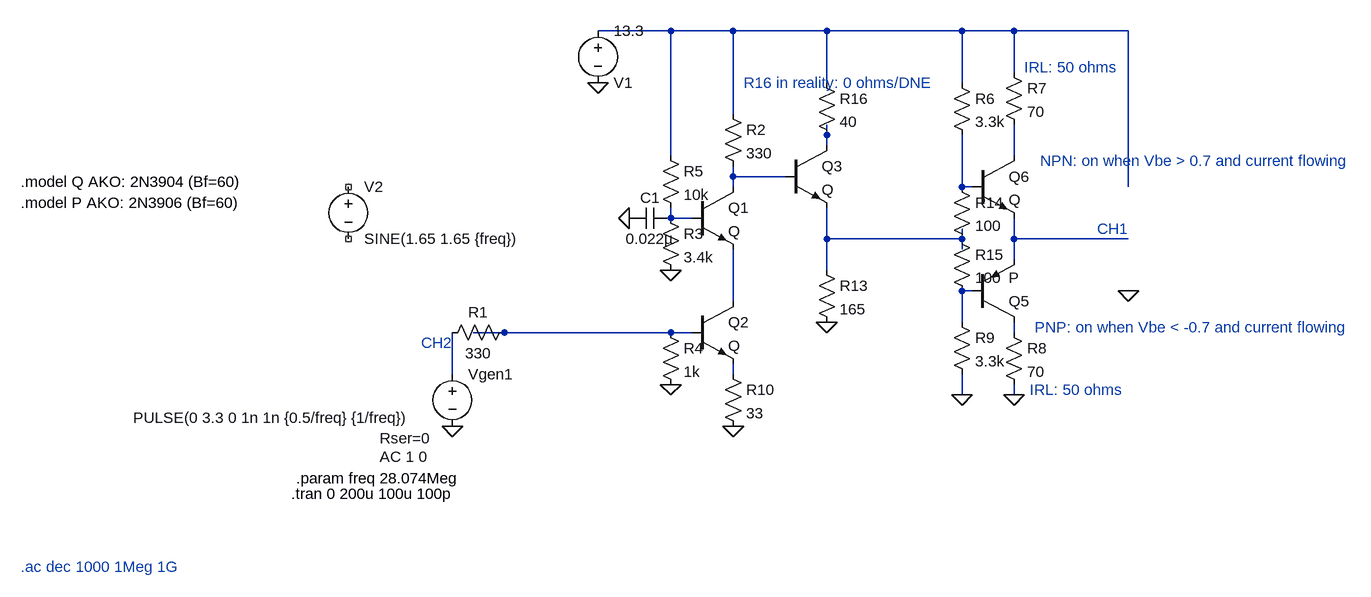
[diagram p0: schematic cascode.asc]
cascode.asc, the LTspice schematic file:
Version 4
SHEET 1 1604 680
WIRE 128 -480 16 -480
WIRE 224 -480 128 -480
WIRE 368 -480 224 -480
WIRE 576 -480 368 -480
WIRE 656 -480 576 -480
WIRE 832 -480 656 -480
WIRE 656 -416 656 -480
WIRE 368 -400 368 -480
WIRE 576 -400 576 -480
WIRE 224 -352 224 -480
WIRE 368 -320 368 -336
WIRE 368 -304 368 -320
WIRE 128 -288 128 -480
WIRE 656 -288 656 -336
WIRE 224 -256 224 -272
WIRE 304 -256 224 -256
WIRE 224 -240 224 -256
WIRE 576 -240 576 -320
WIRE 592 -240 576 -240
WIRE 832 -240 832 -480
WIRE 128 -192 128 -208
WIRE 160 -192 128 -192
WIRE 368 -160 368 -208
WIRE 576 -160 576 -176
WIRE 576 -160 368 -160
WIRE 656 -160 656 -192
WIRE 832 -160 656 -160
WIRE 576 -144 576 -160
WIRE 656 -128 656 -160
WIRE 368 -112 368 -160
WIRE 592 -80 576 -80
WIRE 224 -64 224 -144
WIRE 576 -32 576 -80
WIRE -128 -16 -176 -16
WIRE 128 -16 -128 -16
WIRE 160 -16 128 -16
WIRE 656 -16 656 -32
WIRE -208 48 -208 -16
WIRE 224 48 224 32
WIRE 576 80 576 48
WIRE 656 80 656 64
FLAG -208 128 0
FLAG 16 -400 0
FLAG 128 64 0
FLAG 64 -192 0
FLAG 224 128 0
FLAG 128 -112 0
FLAG 656 80 0
FLAG 576 80 0
FLAG 368 -32 0
FLAG 832 -80 0
SYMBOL voltage -208 32 R0
WINDOW 123 -112 143 Left 2
WINDOW 39 -112 115 Left 2
WINDOW 3 -491 83 Left 2
SYMATTR Value2 AC 1 0
SYMATTR SpiceLine Rser=0
SYMATTR Value PULSE(0 3.3 0 1n 1n {0.5/freq} {1/freq})
SYMATTR InstName Vgen1
SYMBOL res -112 -32 R90
WINDOW 0 0 56 VBottom 2
WINDOW 3 32 56 VTop 2
SYMATTR InstName R1
SYMATTR Value 330
SYMBOL npn 160 -64 R0
SYMATTR InstName Q2
SYMATTR Value Q
SYMBOL res 208 -368 R0
SYMATTR InstName R2
SYMATTR Value 330
SYMBOL voltage 16 -496 R0
WINDOW 0 24 96 Left 2
WINDOW 3 24 16 Left 2
WINDOW 123 0 0 Left 0
WINDOW 39 0 0 Left 0
SYMATTR InstName V1
SYMATTR Value 13.3
SYMBOL res 112 -32 R0
SYMATTR InstName R4
SYMATTR Value 1k
SYMBOL cap 128 -208 R90
WINDOW 0 0 32 VBottom 2
WINDOW 3 32 32 VTop 2
SYMATTR InstName C1
SYMATTR Value 0.022µ
SYMBOL res 112 -304 R0
SYMATTR InstName R5
SYMATTR Value 10k
SYMBOL res 208 32 R0
SYMATTR InstName R10
SYMATTR Value 33
SYMBOL voltage -368 -256 R0
WINDOW 123 0 0 Left 0
WINDOW 39 0 0 Left 0
SYMATTR InstName V2
SYMATTR Value SINE(1.65 1.65 {freq})
SYMBOL npn 160 -240 R0
SYMATTR InstName Q1
SYMATTR Value Q
SYMBOL res 112 -208 R0
SYMATTR InstName R3
SYMATTR Value 3.4k
SYMBOL pnp 592 -32 M180
SYMATTR InstName Q5
SYMATTR Value P
SYMBOL npn 592 -288 R0
SYMATTR InstName Q6
SYMATTR Value Q
SYMBOL res 640 -432 R0
SYMATTR InstName R7
SYMATTR Value 70
SYMBOL res 640 -32 R0
SYMATTR InstName R8
SYMATTR Value 70
SYMBOL res 560 -416 R0
SYMATTR InstName R6
SYMATTR Value 3.3k
SYMBOL res 560 -48 R0
SYMATTR InstName R9
SYMATTR Value 3.3k
SYMBOL npn 304 -304 R0
SYMATTR InstName Q3
SYMATTR Value Q
SYMBOL res 352 -128 R0
SYMATTR InstName R13
SYMATTR Value 165
SYMBOL res 560 -256 R0
SYMATTR InstName R14
SYMATTR Value 100
SYMBOL res 560 -176 R0
SYMATTR InstName R15
SYMATTR Value 100
SYMBOL res 352 -416 R0
SYMATTR InstName R16
SYMATTR Value 40
TEXT -448 208 Left 2 !.param freq 28.074Meg
TEXT -456 232 Left 2 !.tran 0 200u 100u 100p
TEXT -872 -248 Left 2 !.model Q AKO: 2N3904 (Bf=60)
TEXT -872 344 Left 2 ;.ac dec 1000 1Meg 1G
TEXT -872 -216 Left 2 !.model P AKO: 2N3906 (Bf=60)
TEXT 696 -280 Left 2 ;NPN: on when Vbe > 0.7 and current flowing
TEXT 688 -24 Left 2 ;PNP: on when Vbe < -0.7 and current flowing
TEXT 240 -400 Left 2 ;R16 in reality: 0 ohms/DNE
TEXT 672 -424 Left 2 ;IRL: 50 ohms
TEXT 680 72 Left 2 ;IRL: 50 ohms
TEXT 784 -176 Left 2 ;CH1
TEXT -256 0 Left 2 ;CH2

The netlist it stands for:
* cascode.asc
Vgen1 N013 0 PULSE(0 3.3 0 1n 1n {0.5/freq} {1/freq}) AC 1 0 Rser=0
R1 N011 N013 330
Q2 N010 N011 N014 0 Q
R2 N001 N004 330
V1 N001 0 13.3
R4 N011 0 1k
C1 N006 0 0.022µ
R5 N001 N006 10k
R10 N014 0 33
V2 NC_01 NC_02 SINE(1.65 1.65 {freq})
Q1 N004 N006 N010 0 Q
R3 N006 0 3.4k
Q5 N012 N009 N008 0 P
Q6 N003 N005 N008 0 Q
R7 N001 N003 70
R8 N012 0 70
R6 N001 N005 3.3k
R9 N009 0 3.3k
Q3 N002 N004 N007 0 Q
R13 N007 0 165
R14 N005 N007 100
R15 N007 N009 100
R16 N001 N002 40
.model NPN NPN
.model PNP PNP
.lib standard.bjt
.param freq 28.074Meg
.tran 0 200u 100u 100p
.model Q AKO: 2N3904 (Bf=60)
* .ac dec 1000 1Meg 1G
.model P AKO: 2N3906 (Bf=60)
* NPN: on when Vbe > 0.7 and current flowing
* PNP: on when Vbe < -0.7 and current flowing
* R16 in reality: 0 ohms/DNE
* IRL: 50 ohms
* IRL: 50 ohms
* CH1
* CH2
.backanno
.end